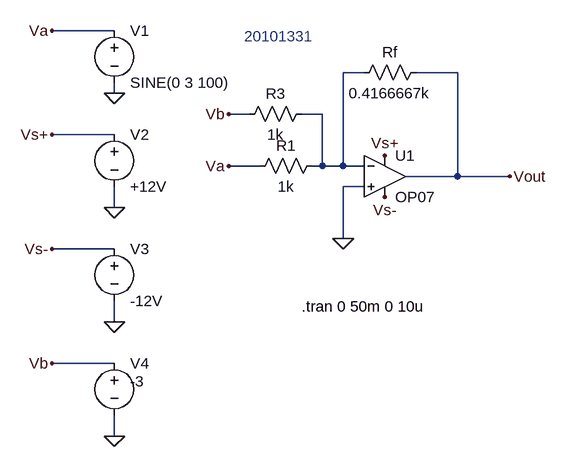
[diagram p0: schematic Inverting Summing Amplifier.asc]
Inverting Summing Amplifier.asc, the LTspice schematic file:
Version 4
SHEET 1 880 680
WIRE -112 -96 -208 -96
WIRE 272 -32 240 -32
WIRE 416 -32 352 -32
WIRE -112 0 -112 -16
WIRE 96 32 64 32
WIRE 208 32 176 32
WIRE -112 64 -208 64
WIRE 112 112 64 112
WIRE 208 112 208 32
WIRE 208 112 192 112
WIRE 240 112 240 -32
WIRE 240 112 208 112
WIRE 272 112 240 112
WIRE 416 128 416 -32
WIRE 416 128 336 128
WIRE 496 128 416 128
WIRE 272 144 240 144
WIRE -112 176 -112 144
WIRE 240 224 240 144
WIRE -112 240 -208 240
WIRE -112 352 -112 320
WIRE -112 416 -208 416
WIRE -112 528 -112 496
FLAG -112 0 0
FLAG -112 176 0
FLAG -112 352 0
FLAG 304 96 Vs+
FLAG 304 160 Vs-
FLAG -208 64 Vs+
FLAG -208 240 Vs-
FLAG -208 -96 Va
FLAG 496 128 Vout
FLAG -208 416 Vb
FLAG 64 32 Vb
FLAG 64 112 Va
FLAG -112 528 0
FLAG 240 224 0
SYMBOL OpAmps\\OP07 304 64 R0
SYMATTR InstName U1
SYMBOL voltage -112 -112 R0
WINDOW 123 0 0 Left 0
WINDOW 39 0 0 Left 0
SYMATTR InstName V1
SYMATTR Value SINE(0 3 100)
SYMBOL voltage -112 48 R0
WINDOW 123 0 0 Left 0
WINDOW 39 0 0 Left 0
SYMATTR InstName V2
SYMATTR Value +12V
SYMBOL voltage -112 224 R0
WINDOW 123 0 0 Left 0
WINDOW 39 0 0 Left 0
SYMATTR InstName V3
SYMATTR Value -12V
SYMBOL res 208 96 R90
WINDOW 0 0 56 VBottom 2
WINDOW 3 32 56 VTop 2
SYMATTR InstName R1
SYMATTR Value 1k
SYMBOL res 368 -48 R90
WINDOW 0 0 56 VBottom 2
WINDOW 3 32 56 VTop 2
SYMATTR InstName Rf
SYMATTR Value 0.4166667k
SYMBOL voltage -112 400 R0
WINDOW 3 24 44 Left 2
WINDOW 123 0 0 Left 0
WINDOW 39 0 0 Left 0
SYMATTR InstName V4
SYMATTR Value -3
SYMBOL res 192 16 R90
WINDOW 0 0 56 VBottom 2
WINDOW 3 32 56 VTop 2
SYMATTR InstName R3
SYMATTR Value 1k
TEXT 176 328 Left 2 !.tran 0 50m 0 10u
TEXT 88 -88 Left 2 ;20101331

The netlist it stands for:
* Inverting Summing Amplifier.asc
XU1 0 N001 Vs+ Vs- Vout LT1001  ; OP07, pins In+ In- V+ V- OUT
V1 Va 0 SINE(0 3 100)
V2 Vs+ 0 +12V
V3 Vs- 0 -12V
R1 N001 Va 1k
Rf Vout N001 0.4166667k
V4 Vb 0 -3
R3 N001 Vb 1k
.tran 0 50m 0 10u
* 20101331
.lib LTC.lib
.backanno
.end